# EAGLE design Controller_4TE_3.55 (EAGLE 6.2)
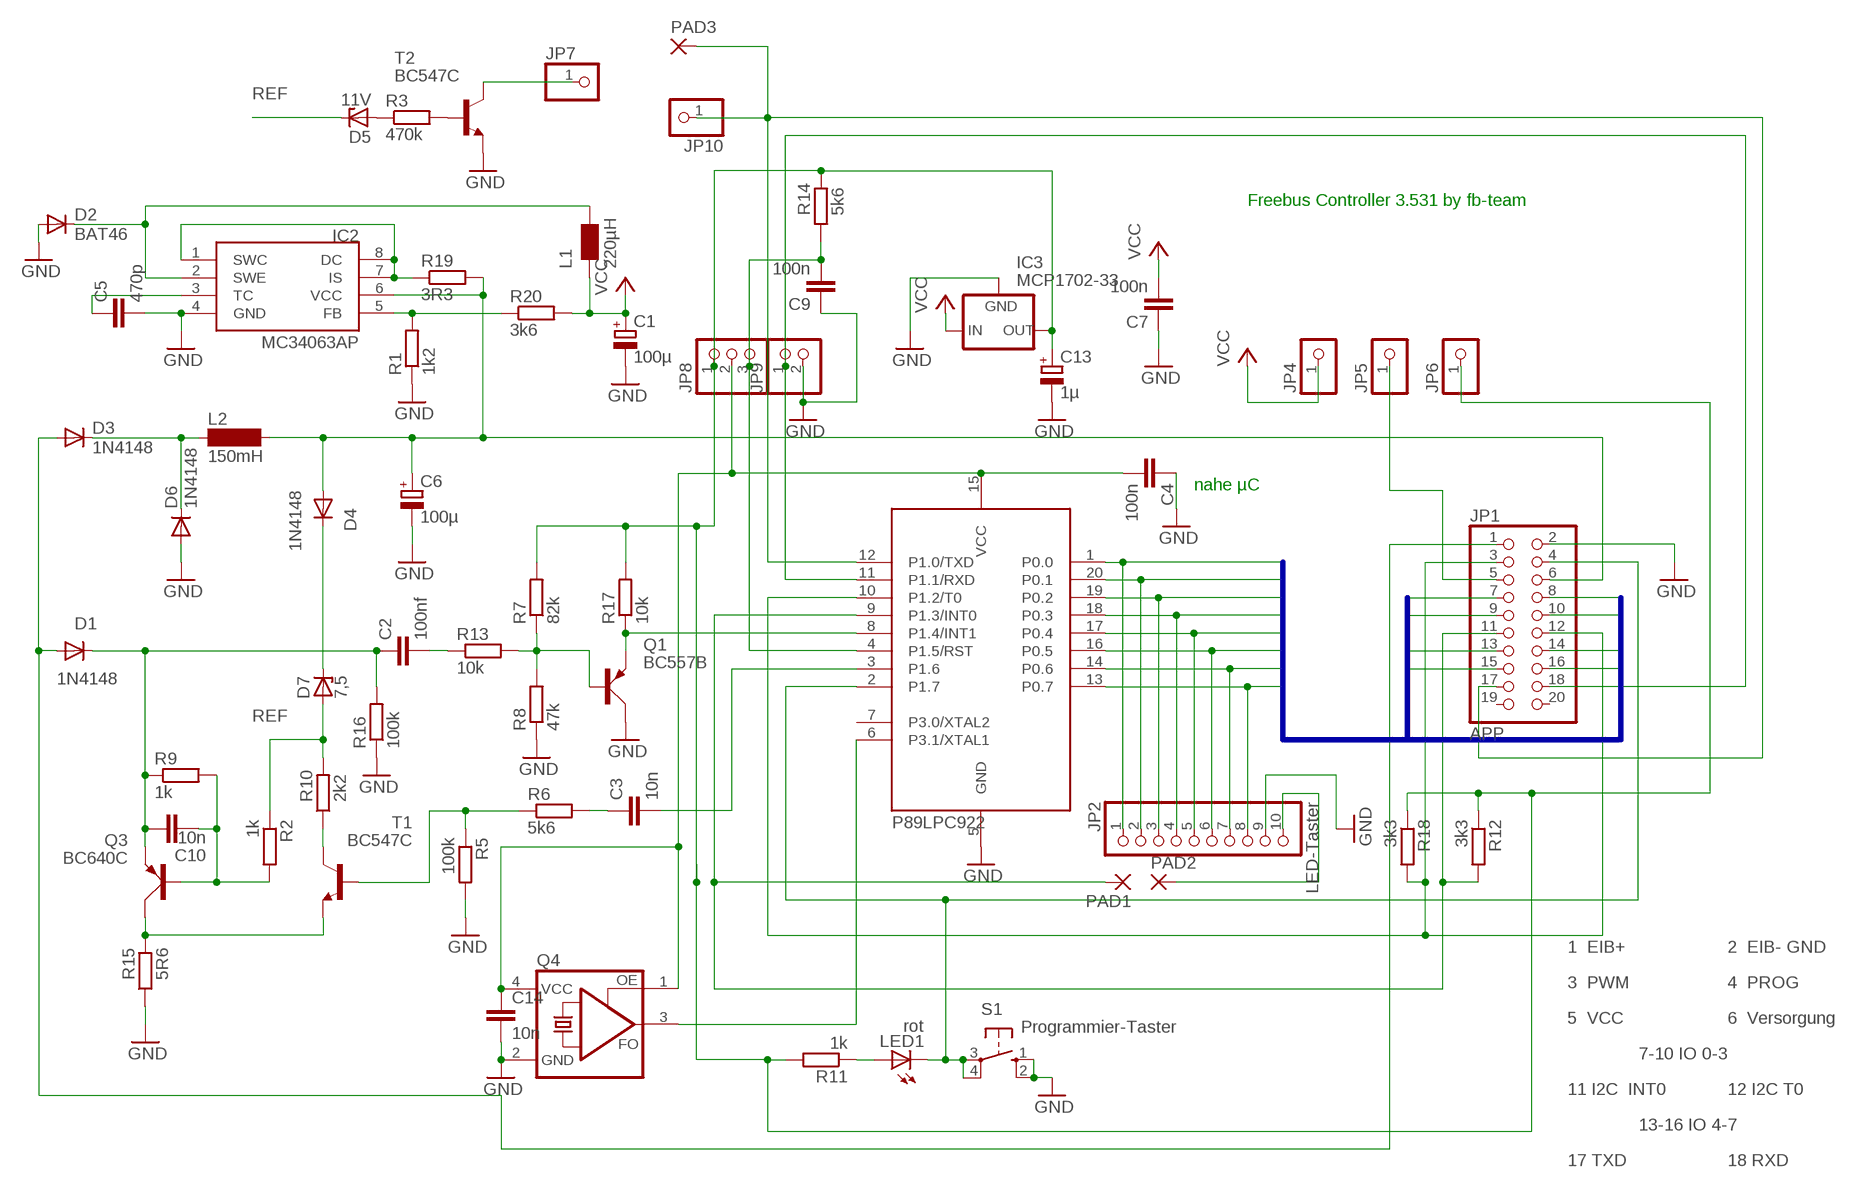
[diagram p0: schematic, sheet 1]

## Parts
C1  100µ  CPOL-EUE5-8.5  [E5-8,5]
C2  100nf  C-EU050-024X044  [C050-024X044]
C3  10n  C-EU050-024X044  [C050-024X044]
C4  100n  C-EU050-024X044  [C050-024X044]
C5  470p  C-EU025-024X044  [C025-024X044]
C6  100µ  CPOL-EUE5-8.5  [E5-8,5]
C7  100n  C-EU050-024X044  [C050-024X044]
C9  100n  C-EU050-024X044  [C050-024X044]
C10  10n  C-EU050-024X044  [C050-024X044]
C13  1µ  CPOL-EUE2-4  [E2-4]
C14  10n  C-EUC1206  [C1206]
D1  1N4148  1N4148DO35-7  [DO35-7]
D2  BAT46  DIODE-C1702-05  [C1702-05]
D3  1N4148  DIODE-D-2.5  [D-2.5]
D4  1N4148  1N4148DO35-10  [DO35-10]
D5  11V  ZENER-DIODEZD-10  [ZDIO-10]
D6  1N4148  DIODE-D-2.5  [D-2.5]
D7  7,5  ZENER-DIODEZD-7.5  [ZDIO-7.5]
IC1  89LPC922FN  89LPC922  [DIL20]
IC2  MC34063AP  [DIL08]
IC3  MCP1702-33  79LXX  [79LXX]
JP1  APP  PINHD-2X10  [2X10]
JP2  LED-Taster  PINHD-1X10  [1X10]
JP4  PINHD-1X1  [1X01]
JP5  PINHD-1X1  [1X01]
JP6  PINHD-1X1  [1X01]
JP7  PINHD-1X1  [1X01]
JP8  PINHD-1X3  [1X03]
JP9  PINHD-1X2  [1X02]
JP10  PINHD-1X1  [1X01]
L1  220µH  L_R85  [L_RAD_D8RM5]
L2  150mH  SD12-1000  [SD12_1000]
LED1  rot  LED3MM  [LED3MM]
PAD1  SMD2  [SMD1,27-2,54]
PAD2  SMD2  [SMD1,27-2,54]
PAD3  SMD2  [SMD1,27-2,54]
Q1  BC557B  BC557  [SOT54A]
Q3  BC640C  BC640  [SOT54D]
Q4  ASFL  [ASF]
R1  1k2  R-EU_0207/10  [0207/10]
R2  1k  R-EU_0207/7  [0207/7]
R3  470k  R-EU_0207/7  [0207/7]
R5  100k  R-EU_0207/10  [0207/10]
R6  5k6  R-EU_0207/7  [0207/7]
R7  82k  R-EU_0207/7  [0207/7]
R8  47k  R-EU_0207/7  [0207/7]
R9  1k  R-EU_0207/7  [0207/7]
R10  2k2  R-EU_0207/7  [0207/7]
R11  1k  R-EU_0207/7  [0207/7]
R12  3k3  R-EU_0207/10  [0207/10]
R13  10k  R-EU_0207/7  [0207/7]
R14  5k6  R-EU_0207/10  [0207/10]
R15  5R6  R-EU_0207/10  [0207/10]
R16  100k  R-EU_0207/7  [0207/7]
R17  10k  R-EU_0207/7  [0207/7]
R18  3k3  R-EU_0207/10  [0207/10]
R19  3R3  R-EU_0207/10  [0207/10]
R20  3k6  R-EU_0207/10  [0207/10]
S1  Programmier-Taster  10-XX  [B3F-10XX]
T1  BC547C  BC547  [TO92]
T2  BC547C  BC547  [TO92]

## Nets
/RESTET: C9.2 IC1.4(P1.5/RST) JP8.3 R14.1
DRAIN: C2.1 C10.1 D1.C Q3.E R9.1 R16.2
EIB_DC: C6.+ D4.A IC2.6(VCC) JP1.6 L2.2 R19.2
EIBIN: IC1.8(P1.4/INT1) Q1.E R17.1
GND: C1.- C4.1 C5.2 C6.- C7.1 C9.1 C13.- C14.2 D2.A D6.A IC1.5(GND) IC2.4(GND) IC3.GND JP1.2 JP2.9 JP9.2 Q1.C Q4.2(GND) R1.1 R5.2 R8.1 R15.1 R16.1 S1.1(S) S1.2(S1) T2.1(E)
INT0_TASTER: IC1.9(P1.3/INT0) JP1.11 PAD1.1(P) R12.2
N$1: C3.1 R6.2
N$2: C2.2 R13.1
N$3: IC2.5(FB) R1.2 R20.1
N$4: IC2.1(SWC) IC2.7(IS) IC2.8(DC) R19.1
N$5: C3.2 IC1.3(P1.6)
N$6: R10.1 T1.3(C)
N$7: Q3.C R15.2 T1.1(E)
N$8: D3.C D6.C L2.1
N$9: D4.C D7.C
N$10: D2.C IC2.2(SWE) L1.1
N$11: JP7.1 T2.3(C)
N$12: R5.1 R6.1 T1.2(B)
N$13: C5.1 IC2.3(TC)
N$14: Q1.B R7.1 R8.2 R13.2
N$15: C10.2 Q3.B R2.2 R9.2
N$16: D1.A D3.A JP1.1
N$17: IC1.6(P3.1/XTAL1) Q4.3(FO)
N$20: JP1.5 JP5.1
N$28: R3.2 T2.2(B)
N$29: JP2.10 PAD2.1(P)
N$30: IC1.11(P1.1/RXD) JP1.18 JP9.1
N$31: D5.A R3.1
N$41: LED1.A R11.1
P0.0: IC1.1(P0.0) JP1.7 JP2.1
P0.1: IC1.20(P0.1) JP1.8 JP2.2
P0.2: IC1.19(P0.2) JP1.9 JP2.3
P0.3: IC1.18(P0.3) JP1.10 JP2.4
P0.4: IC1.17(P0.4) JP1.13 JP2.5
P0.5: IC1.16(P0.5) JP1.14 JP2.6
P0.6: IC1.14(P0.6) JP1.15 JP2.7
P0.7: IC1.13(P0.7) JP1.16 JP2.8
PROG: IC1.2(P1.7) JP1.4 LED1.K(C) S1.3(P) S1.4(P1)
PWM: IC1.10(P1.2/T0) JP1.3 JP1.12 R18.2
REF: D5.C D7.A R2.1 R10.2
TXD: IC1.12(P1.0/TXD) JP1.17 JP10.1 PAD3.1(P)
VCC3V3: C1.+ C7.2 IC3.IN JP4.1 L1.2 R20.2 ; supply symbol labelled VCC
VCC_3V3: C13.+ IC3.OUT JP6.1 JP8.1 R7.2 R11.2 R12.1 R14.2 R17.2 R18.1
VCC_LPC: C4.2 C14.1 IC1.15(VCC) JP8.2 Q4.1(OE) Q4.4(VCC)
Unconnected: IC1.7(P3.0/XTAL2) JP1.19 JP1.20

## Buses
P0.[0..7]

## Notes on the sheet
- Freebus Controller 3.531 by fb-team
- nahe µC
- P89LPC922
- 1  EIB+ | 2  EIB- GND
- 3  PWM | 4  PROG
- 5  VCC | 6  Versorgung
- 7-10 IO 0-3
- 11 I2C  INT0 | 12 I2C T0
- 13-16 IO 4-7
- 17 TXD | 18 RXD

## Library data of the parts
C1 C6 C13 = rcl:CPOL-EU: POLARIZED CAPACITOR, European symbol
C2-C5 C7 C9 C10 C14 = rcl:C-EU: CAPACITOR, European symbol
D1 D4 = diode:1N4148: DIODE high speed (Philips)
D2 D3 D6 = diode:DIODE-: DIODE
D5 D7 = diode:ZENER-DIODE: Z-Diode
IC1 = micro-philips:89LPC922
IC2 = mc34063:MC34063
IC3 = v-reg:79LXX: VOLTAGE REGULATOR
JP1 = pinhead:PINHD-2X10: PIN HEADER
JP2 = pinhead:PINHD-1X10: PIN HEADER
JP4-JP7 JP10 = pinhead:PINHD-1X1: PIN HEADER
JP8 = pinhead:PINHD-1X3: PIN HEADER
JP9 = pinhead:PINHD-1X2: PIN HEADER
L1 = fbctrls1:L
L2 = inductor-neosid:SD12: INDUCTOR nominal inductance
LED1 = led:LED: LED OSRAM: - CHIPLED LG R971, LG N971, LY N971, LG Q971, LY Q971, LO R971, LY R971 LH N974, LH R974 LS Q976, LO Q976, LY Q976 LO Q996 - Hyper CHIPLED LW Q18S LB Q993, LB Q99A, LB R99A - SideLED LS A670, LO A670, LY A670, LG A670, LP A670 LB A673, LV A673, LT A673, LW A673 LH A674 LY A675 LS A676, LA A676, LO A676, LY A676, LW A676 LS A679, LY A679, LG A679 - Hyper Micro SIDELED® LS Y876, LA Y876, LO Y876, LY Y876 LT Y87S - SmartLED LW L88C, LW L88S LB L89C, LB L89S, LG L890 LS L89K, LO L89K, LY L89K LS L896, LA L896, LO L896, LY L896 - TOPLED LS T670, LO T670, LY T670, LG T670, LP T670 LSG T670, LSP T670, LSY T670, LOP T670, LYG T670 LG T671, LOG T671, LSG T671 LB T673, LV T673, LT T673, LW T673 LH T674 LS T676, LA T676, LO T676, LY T676, LB T676, LH T676, LSB T676, LW T676 LB T67C, LV T67C, LT T67C, LS T67K, LO T67K, LY T67K, LW E67C LS E67B, LA E67B, LO E67B, LY E67B, LB E67C, LV E67C, LT E67C LW T67C LS T679, LY T679, LG T679 LS T770, LO T770, LY T770, LG T770, LP T770 LB T773, LV T773, LT T773, LW T773 LH T774 LS E675, LA E675, LY E675, LS T675 LS T776, LA T776, LO T776, LY T776, LB T776 LHGB T686 LT T68C, LB T68C - Hyper Mini TOPLED® LB M676 - Mini TOPLED Santana® LG M470 LS M47K, LO M47K, LY M47K Source: http://www.osram.convergy.de - LUMILED® LXK2-PW12-R00, LXK2-PW12-S00, LXK2-PW14-U00, LXK2-PW14-V00 LXK2-PM12-R00, LXK2-PM12-S00, LXK2-PM14-U00 LXK2-PE12-Q00, LXK2-PE12-R00, LXK2-PE12-S00, LXK2-PE14-T00, LXK2-PE14-U00 LXK2-PB12-K00, LXK2-PB12-L00, LXK2-PB12-M00, LXK2-PB14-N00, LXK2-PB14-P00, LXK2-PB14-Q00 LXK2-PR12-L00, LXK2-PR12-M00, LXK2-PR14-Q00, LXK2-PR14-R00 LXK2-PD12-Q00, LXK2-PD12-R00, LXK2-PD12-S00 LXK2-PH12-R00, LXK2-PH12-S00 LXK2-PL12-P00, LXK2-PL12-Q00, LXK2-PL12-R00 Source: www.luxeon.com
PAD1-PAD3 = wirepad:SMD2: SMD PAD
Q1 = transistor-small-signal:BC557: PNP TRANSISTOR
Q3 = transistor-small-signal:BC640: PNP TRANSISTOR
Q4 = crystal:ASF*: CRYSTAL CLOCK OSCILLATORS 5.0 Vdc or 3.3 Vdc - LOW PROFILE ULTRA MINIATURE CERAMIC SURFACE MOUNT Source: http://www.abracon.com/Oscillators/asf1-L-L1.pdf
R1-R3 R5-R20 = rcl:R-EU_: RESISTOR, European symbol
S1 = switch-omron:10-XX: OMRON SWITCH
T1 T2 = transistor:BC547: NPN TRANSISTOR

## Board
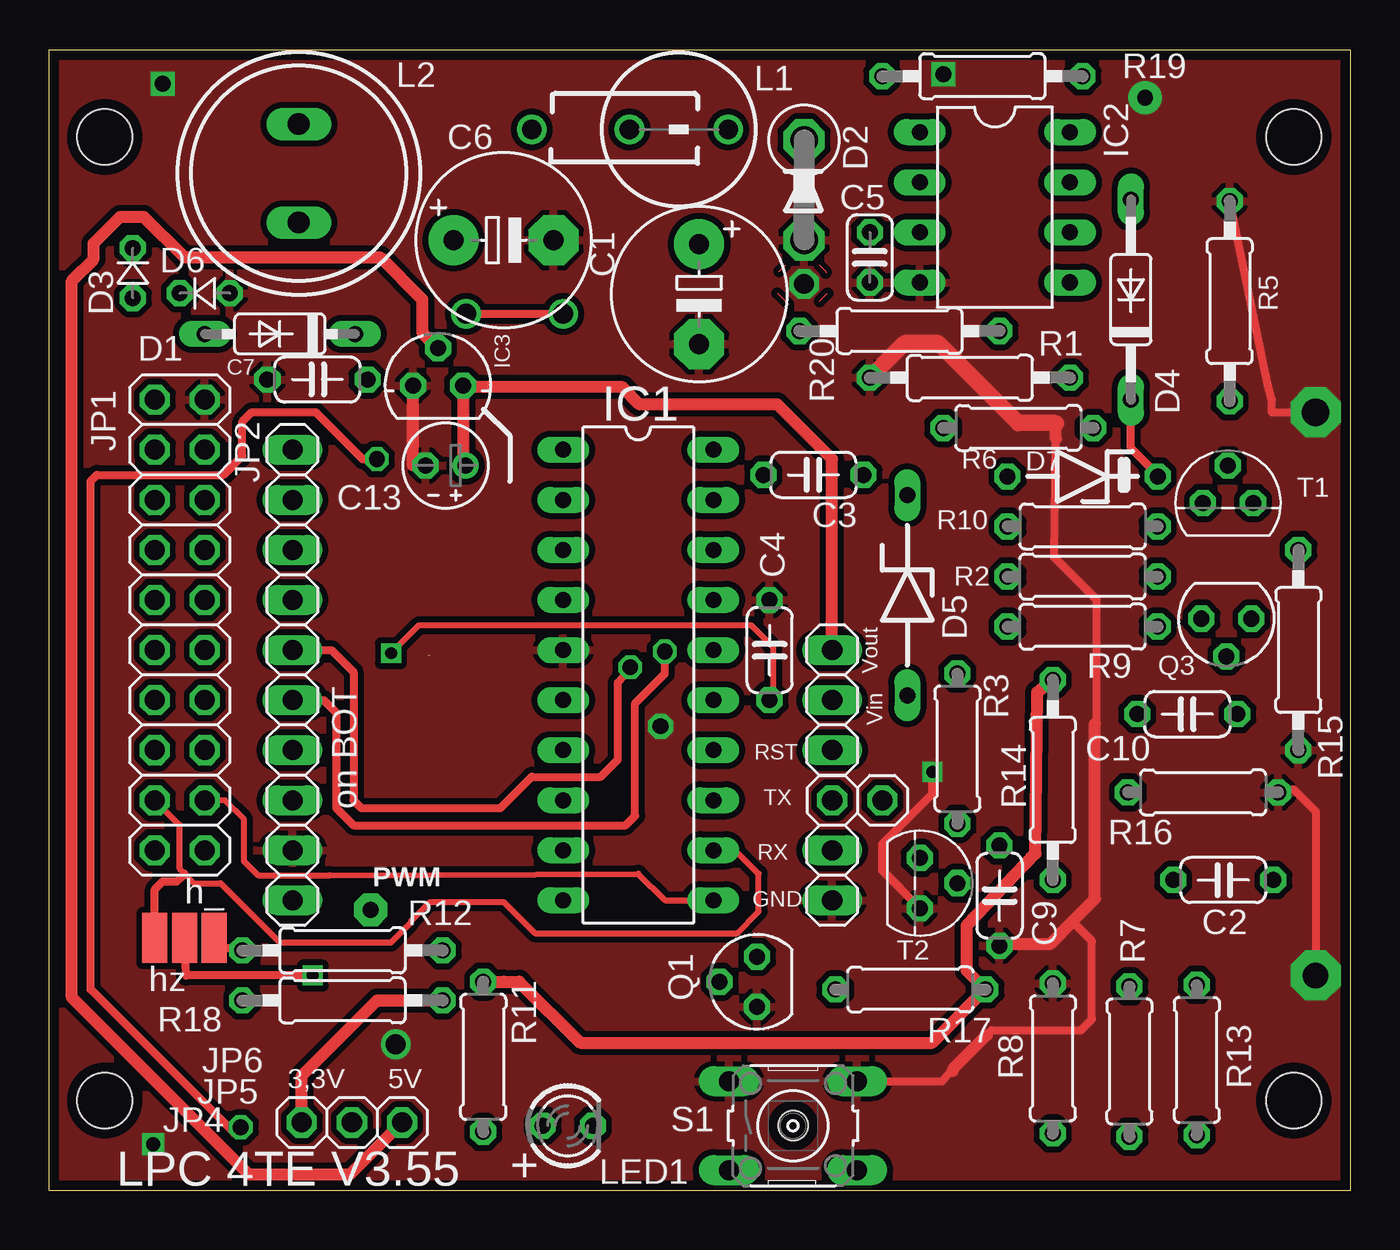
[diagram p1: board, top side]
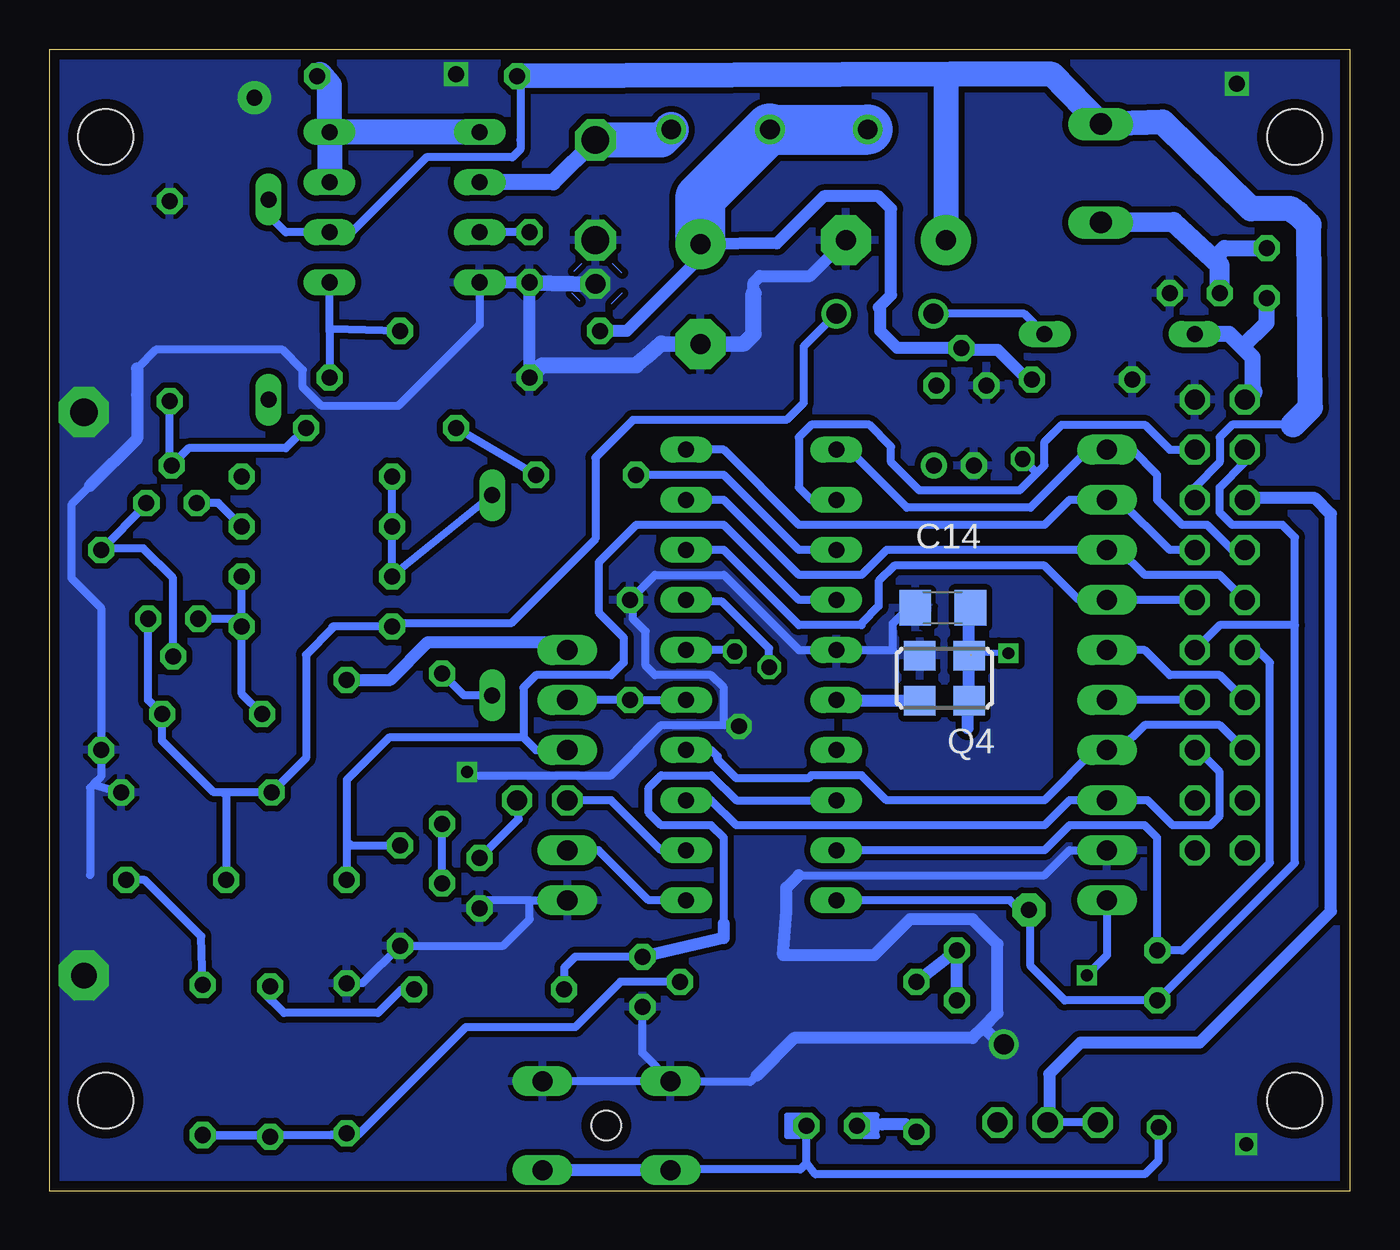
[diagram p2: board, bottom side, seen from below]

Size 66 x 57.9 mm. Coordinates in mm from the lower left corner, seen from the top.
Outline: 0,57.9 66,57.9 66,0 0,0 0,57.9
Copper layers (1*16): Top 0.035mm / dielectric 1.5mm / Bottom 0.035mm
Design rules: minimum track width 10mil, minimum drill 24mil, track to track 12mil, track to pad 12mil, pad to pad 12mil, via to via 12mil, smd to smd 8mil, copper to edge 20mil, drill to drill 8mil, minimum pad ring 10mil, minimum via ring 8mil, stop-mask expansion 4mil, vias tented up to drill 0mil, thermal gap 10mil
Holes 2.8 mm at 2.81,53.48 63.14,53.48 63.14,4.58 2.81,4.58
Holes 1.5 mm at 37.73,3.31
bRestrict: 5 lines

### Footprints (pad centres in the part's own frame; a part is rotated, then mirrored left to right if it is on the bottom)
E5-8,5 = drill 1.016 pad 2.54: + -2.54,0 | drill 1.016 pad 2.54 octagon: - 2.54,0
C050-024X044 = drill 0.813 octagon: 1 -2.54,0; 2 2.54,0
C025-024X044 = drill 0.813 octagon: 1 -1.27,0; 2 1.27,0
E2-4 = drill 0.813 pad 1.27: + -1.016,0 | drill 0.813 pad 1.27 octagon: - 1.016,0
C1206 = smd 1.6 x 1.8: 1 -1.4,0; 2 1.4,0
DO35-7 = drill 0.813 long: A 3.81,0; C -3.81,0
C1702-05 = drill 1.397 octagon: A 2.54,0; C -2.54,0
D-2.5 = drill 0.813 octagon: A 1.27,0; C -1.27,0
DO35-10 = drill 0.813 long: A 5.08,0; C -5.08,0
ZDIO-10 = drill 0.813 long: A 5.08,0; C -5.08,0
ZDIO-7.5 = drill 0.813 octagon: A 3.81,0; C -3.81,0
DIL20 = drill 0.813 long: 1 -11.43,-3.81; 2 -8.89,-3.81; 3 -6.35,-3.81; 4 -3.81,-3.81; 5 -1.27,-3.81; 6 1.27,-3.81; 7 3.81,-3.81; 8 6.35,-3.81; 9 8.89,-3.81; 10 11.43,-3.81; 11 11.43,3.81; 12 8.89,3.81; 13 6.35,3.81; 14 3.81,3.81; 15 1.27,3.81; 16 -1.27,3.81; 17 -3.81,3.81; 18 -6.35,3.81; 19 -8.89,3.81; 20 -11.43,3.81
DIL08 = drill 0.813 long: 1 -3.81,-3.81; 2 -1.27,-3.81; 3 1.27,-3.81; 4 3.81,-3.81; 5 3.81,3.81; 6 1.27,3.81; 7 -1.27,3.81; 8 -3.81,3.81
79LXX = drill 0.813 octagon: GND -1.27,0; IN 0,1.905; OUT 1.27,0
2X10 = drill 1.016 octagon: 1 -11.43,-1.27; 2 -11.43,1.27; 3 -8.89,-1.27; 4 -8.89,1.27; 5 -6.35,-1.27; 6 -6.35,1.27; 7 -3.81,-1.27; 8 -3.81,1.27; 9 -1.27,-1.27; 10 -1.27,1.27; 11 1.27,-1.27; 12 1.27,1.27; 13 3.81,-1.27; 14 3.81,1.27; 15 6.35,-1.27; 16 6.35,1.27; 17 8.89,-1.27; 18 8.89,1.27; 19 11.43,-1.27; 20 11.43,1.27
1X10 = drill 1.016 long: 1 -11.43,0; 2 -8.89,0; 3 -6.35,0; 4 -3.81,0; 5 -1.27,0; 6 1.27,0; 7 3.81,0; 8 6.35,0; 9 8.89,0; 10 11.43,0
1X01 = drill 1.016 octagon: 1 0,0
1X03 = drill 1.016 long: 1 -2.54,0; 2 0,0; 3 2.54,0
1X02 = drill 1.016 long: 1 -1.27,0; 2 1.27,0
L_RAD_D8RM5 = drill 1: 1 -2.5,0; 2 2.5,0
SD12_1000 = drill 1.1 long: 1 -2.5,0; 2 2.5,0
LED3MM = drill 0.813 octagon: A -1.27,0; K 1.27,0
SMD1,27-2,54 = smd 1.27 x 2.54: 1 0,0
SOT54A = drill 0.813 octagon: B 0,1.905; C -1.27,0; E 1.27,0
SOT54D = drill 0.813 octagon: B 1.27,0; C 0,1.905; E -1.27,0
ASF = smd 1.6 x 1.5: 1 -1.25,-1.15; 2 1.25,-1.15; 3 1.25,1.15; 4 -1.25,1.15
0207/10 = drill 0.813 octagon: 1 -5.08,0; 2 5.08,0
0207/7 = drill 0.813 octagon: 1 -3.81,0; 2 3.81,0
B3F-10XX = drill 1.016 long: 1 -3.251,2.261; 2 3.251,2.261; 3 -3.251,-2.261; 4 3.251,-2.261
TO92 = drill 0.813 octagon: 1 1.27,0; 2 0,1.905; 3 -1.27,0

### Placement (x,y rotation side)
C1  32.97,45.5 270 top
C2  59.56,15.77 0 top
C3  38.77,36.33 180 top
C4  36.54,27.44 270 top
C5  41.62,47.36 270 top
C6  23.05,48.24 0 top
C7  13.61,41.17 0 top
C9  48.21,14.98 90 top
C10  57.74,24.19 180 top
C13  20.11,36.81 180 top
C14  20.67,29.58 180 bottom
D1  11.7,43.47 180 top
D2  38.29,50.78 270 top
D3  4.24,46.57 270 top
D4  54.88,45.22 90 top
D5  43.53,30.22 270 top
D6  7.89,45.54 0 top
D7  52.42,36.25 180 top
IC1  29.88,26.17 270 top
IC2  47.97,49.9 270 top
IC3  19.72,40.85 0 top
JP1  6.62,28.71 270 top
JP2  12.34,26.17 270 top
JP4  17.89,3.47 0 top
JP5  15.35,3.47 0 top
JP6  12.81,3.47 0 top
JP7  42.26,19.82 0 top
JP8  39.72,24.9 270 top
JP9  39.72,16.01 270 top
JP10  39.72,19.82 0 top
L1  31.94,53.85 180 top
L2  12.65,51.63 90 top
LED1  26.3,3.31 0 top
PAD1  8.37,12.84 0 top
PAD2  6.86,12.84 0 top
PAD3  5.35,12.84 0 top
Q1  35.91,10.61 90 top
Q3  59.72,29.03 180 top
Q4  20.59,26.01 180 bottom
R1  46.7,41.25 0 top
R2  52.42,31.17 0 top
R3  46.07,22.44 270 top
R5  59.88,45.14 90 top
R6  49.16,38.71 180 top
R7  54.8,6.56 90 top
R8  50.91,6.72 270 top
R9  52.42,28.63 0 top
R10  52.42,33.71 180 top
R11  22.02,6.8 90 top
R12  14.88,12.2 180 top
R13  58.21,6.64 270 top
R14  50.91,20.85 90 top
R15  63.37,27.44 90 top
R16  58.53,20.22 180 top
R17  43.69,10.22 0 top
R18  14.88,9.66 180 top
R19  47.34,56.55 180 top
R20  43.13,43.63 180 top
S1  37.73,3.31 0 top
T1  59.8,34.9 0 top
T2  44.16,15.61 270 top

### Tracks (layer width: path | path; a pad name or v marks a point on that pad's centre or on a via)
/RESTET
  Bottom 0.406: IC1.4 27.97,29.98 31.78,33.79 36.23,33.79 38.13,31.88 38.13,29.34 36.86,28.07 36.86,26.8 37.5,26.17 41.31,26.17 41.94,25.54 41.94,23 | 41.94,23 41.31,22.36 JP8.3 | 50.91,17.76 50.91,20.85 48.77,23 41.94,23 | 50.91,17.76 R14.1 | C9.2 50.67,17.52 50.91,17.76
DRAIN  (via drill 1)
  Top 0.406: v21.15,44.51 v26.07,44.51
  Bottom 0.406: R16.2 57.18,20.22 | 57.18,20.22 57.66,20.22 60.28,22.84 C10.1 60.99,24.9 Q3.E | C2.1 57.02,20.06 57.18,20.22 | R16.2 | D1.C 16.54,44.51 v21.15,44.51 | R16.2 52.98,21.96 52.98,27.2 51.63,28.55 51.63,28.63 R9.1 48.45,28.79 42.58,28.79 38.29,33.08 38.29,37.2 36.39,39.11 28.61,39.11 27.73,39.98 27.73,42.84 v26.07,44.51
EIB_DC
  Bottom 0.406: JP1.6 7.89,35.7 6.62,36.97 6.62,38.23 5.99,38.87 2.89,38.87 | R19.2 42.1,56.17 42.1,53.32 42.1,52.84 42.5,52.44 46.86,52.44 50.67,48.63 IC2.6 54.01,48.63 54.88,49.51 D4.A | D4.A
  Bottom 1.27: 2.89,38.87 2.02,39.74 2.1,48.95 2.1,49.03 2.65,49.59 2.73,49.59 2.97,49.82 5.03,49.82 9.52,54.23 L2.2 15.11,56.65 20.35,56.65 | 20.35,56.65 R19.2 | C6.+ 20.51,56.49 20.35,56.65
EIBIN
  Bottom 0.406: IC1.8 31.15,19.82 32.42,21.09 34.96,21.09 35.59,20.45 35.59,19.18 34.96,18.55 32.42,18.55 31.78,17.91 31.78,12.84 | Q1.E 39.32,11.88 39.88,11.33 R17.1 | R17.1
  Bottom 0.61: 31.78,13.55 31.78,12.84 Q1.E
GND  (via drill 0.6, 0.7, 0.8, 0.8 pad 1.27, 0.8 pad 1.68, 1, 1.3 pad 2.54, 1.4 pad 2.54)
  Top 0.406: v64.25,39.51 62.02,39.51 62.02,40.14 61.79,41.01 R5.2 | 51.07,38.16 50.99,32.12 53.13,29.98 53.13,23.79 53.05,23.71 | v64.25,10.93 64.25,19.26 63.14,20.38 62.5,20.38 R16.1 | 47.58,7.91 47.82,8.15 52.34,8.15 52.9,8.71 52.9,12.68 51.9,13.67 | S1.2 45.31,5.57 45.87,6.21 | v44.8,21.25 44.8,20.14 42.26,17.6 42.26,16.25 T2.1
  Top 0.61: 53.05,23.71 53.05,14.82 51.9,13.67 50.75,12.52 48.29,12.52 C9.1 | 51.07,38.16 51.07,38.95 | 47.58,7.91 45.87,6.21 45.83,6.09 | C13.- 18.45,36.81 IC3.GND
  Top 0.813: 51.07,38.95 49.16,38.95 45.08,43.04 43.41,43.04 R1.1
  Bottom 0.406: 31.78,23.63 31.78,25.54 32.42,26.17 35.27,26.17 35.75,26.65 35.75,28.39 36.39,29.03 36.39,29.82 C4.1 | 31.78,23.63 34.96,23.63 37.5,21.09 44.64,21.09 v44.8,21.25 | JP2.9 14.24,17.28 15.51,16.01 27.97,16.01 | C4.1 35.27,31.25 31.78,31.25 27.97,27.44 IC1.5 23.18,27.44 23.21,27.47 23.21,28.79 22.42,29.58 C14.2 | Q1.C 35.91,7 S1.1 | S1.1 S1.2 | 41.62,14.74 41.62,13.79 42.97,12.44 48.05,12.44 C9.1 50.12,10.53 R8.1 | 63.93,16.01 63.93,20.45 63.77,20.61 | 63.77,20.61 R16.1 | 34.32,5.61 34.24,5.53 30.43,5.53 30.11,5.85 | 34.32,5.61 34.24,5.69 | S1.1 34.36,5.57 34.32,5.61 | IC2.4 44.16,43.95 48.29,39.82 52.18,39.82 53.13,40.77 53.13,41.65 54.17,42.68 60.59,42.68 61.55,41.73 | C4.1 | v31.01,23.57 31.47,23.63 31.78,23.63 | 63.93,35.77 64.88,34.82 64.88,31.09 63.37,29.58 R15.1 63.37,21.01 63.77,20.61 | 41.62,14.74 JP9.2 | 41.62,14.74 43.77,14.74 T2.1 | 61.55,40.38
  Bottom 0.61: S1.1 34.48,5.77 34.56,5.85 | 27.97,16.01 28.61,15.38 28.61,14.18 28.77,11.96 24.16,11.96 22.34,13.79 19.16,13.79 17.89,12.52 17.89,9.03 18.61,8.31 | 30.11,5.85 28.21,7.76 19.16,7.76 18.61,8.31 | IC2.4 C5.2 R1.1 | 61.55,41.73 61.55,40.38 61.55,38.16 63.93,35.77 | v17.57,7.44 17.34,7.04 18.61,8.31 | 30.27,45.54 30.27,46.09 29.96,46.41 27.42,46.41 C6.-
  Bottom 0.813: 30.27,45.54 30.27,43.47 30.75,43 C1.- 34.96,43 35.67,42.36 36.23,41.89 40.99,41.89 R1.1 | C5.2 v38.29,46.01
  other vias: 55.59,55.46 5.27,2.36 5.75,56.17 45.35,56.65
  pour Bottom: -1.16,-0.5 -1,58.55 66.94,58.55 66.94,-0.5
  pour Top: -1.16,58.87 -1.16,-0.82 67.26,-0.82 67.26,58.71 -0.68,58.71
INT0_TASTER
  Top 0.406: PAD1.1 8.41,12.32 9.68,12.32 R12.2
  Bottom 0.406: IC1.9 15.51,17.28 14.24,18.55 10.43,18.55 9.79,17.91 R12.2 8.53,12.2 4.08,16.64 4.08,26.8 4.71,27.44 JP1.11
N$1
  Bottom 0.406: C3.1 R6.2
N$2
  Bottom 0.406: C2.2 61.15,15.77 58.29,12.91 R13.1 | C2.2
N$3
  Bottom 0.406: 51.78,43.63 R1.2 | 51.78,43.63 IC2.5 | R20.1 51.7,43.71 51.78,43.63
N$4
  Bottom 1.27: IC2.1 IC2.8 | IC2.8 IC2.7 | IC2.8 51.78,56.09 52.26,56.65 R19.1
N$5
  Bottom 0.406: IC1.3 27.97,32.52 31.78,36.33 C3.2
N$6
  Bottom 0.406: T1.3 57.42,34.9 R10.1
N$7
  Bottom 0.406: T1.1 61.07,34.82 R15.2 63.29,32.6 61.23,32.6 59.72,31.09 Q3.C
N$8
  Bottom 0.813: D3.C 6.38,47.84 6.94,47.28
  Bottom 1.016: D6.C 6.62,46.97 6.94,47.28 8.96,49.15 L2.1
N$9
  Top 0.406: D4.C 54.88,37.68 56.23,36.33 D7.C | D4.C
N$10
  Bottom 0.813: IC2.2 40.43,51.17 D2.C
  Bottom 1.778: L1.1 34.44,53.83 34.96,53.32 D2.C
N$11
  Bottom 0.406: JP7.1 42.18,18.87 T2.3
N$12
  Bottom 0.406: R6.1 54.01,37.68 58.93,37.68 T1.2 | T1.2 59.56,36.81 | R5.1 59.88,36.97 T1.2
N$13
  Bottom 0.406: C5.1 IC2.3
N$14
  Bottom 0.406: Q1.B 37.02,10.61 39.32,8.31 44.88,8.31 50.36,2.83 51.78,2.83 R8.2 51.94,2.83 R13.2 55.28,2.83 R7.1
N$15
  Bottom 0.406: R2.2 R9.2 | Q3.B 56.63,29.03 R9.2 | R9.2 56.23,25.22 C10.2
N$16
  Bottom 0.61: JP1.1 5.27,40.22
  Bottom 0.813: 4.95,40.54 4.95,42.28 5.47,42.8 | 5.47,42.8 6.14,43.47 D1.A | D3.A 4.24,44.03 5.47,42.8
  Bottom 1.016: 5.27,40.22 4.95,40.54
N$17
  Bottom 0.305: IC1.6 26.07,24.86
  Bottom 0.61: Q4.3 26.03,24.86 IC1.6
N$18
  Top 0: 39.08,46.97 | 39.08,46.97 39.4,46.65 39.4,46.57
N$19
  Bottom 0.61: 19.4,23.47 19.4,24.9
N$20
  Bottom 0.61: JP5.1 15.27,3.55 15.27,5.93 13.68,7.52 7.65,7.52 0.98,14.18 0.98,34.35 1.78,35.14 5.27,35.14 JP1.5
N$21
  Top 0: 39.08,45.14 39.48,45.54
N$22
  Top 0: 37.02,46.65 37.34,46.97 | 37.34,46.97
N$23
  Top 0: 36.94,45.54 37.5,44.98
N$24
  Bottom 0: 36.94,46.57 37.42,47.05
N$25
  Bottom 0: 36.94,45.54 37.5,44.98
N$26
  Bottom 0: 39.08,45.14 39.48,45.54
N$27
  Bottom 0: 39.01,47.05 | 39.01,47.05 39.4,46.65
N$28
  Bottom 0.406: T2.2 R3.2
N$29  (via drill 0.6)
  Top 0.406: v13.37,10.93 6.94,10.93 PAD2.1
  Bottom 0.406: JP2.10 12.34,11.96 v13.37,10.93
N$30
  Top 0.305: JP1.18 8.92,19.82 9.87,18.87 9.87,16.72 10.59,16.01 14.24,16.01 29.88,16.09 31.23,14.74 IC1.11
  Bottom 0.406: IC1.11 35.59,14.74 38.13,17.28 JP9.1
N$31
  Bottom 0.406: D5.A 44.96,25.14 45.04,25.22 R3.1
N$41
  Bottom 0.254: 24.66,3.82 24.68,3.82 24.72,3.86 24.02,3.86 24,3.84 24,3.06 23.98,2.77 24.63,2.77 24.72,2.78 24.72,2.8 | 24.72,2.8 24.48,3.04 24.48,3.63 24.45,3.66 24.23,3.66 24.22,3.67 24.22,2.97 24.34,2.97 24.04,3.38 24.36,3.56 24.36,3.57 | 24.72,2.8 24.72,2.81 23.75,3.38
  Bottom 0.61: R11.1 22.57,3.39 23.75,3.38 LED1.A
P0.0
  Bottom 0.406: JP1.7 5.99,32.52 7.26,33.79 8.53,33.79 9.79,35.06 9.79,36.33 11.06,37.6 JP2.1 13.29,37.6 16.22,34.66 22.5,34.66 25.43,37.6 IC1.1
P0.1
  Bottom 0.406: IC1.20 31.78,37.6 27.97,33.79 15.51,33.79 14.24,35.06 JP2.2 11.7,35.06 9.16,32.52 JP1.8
P0.2
  Bottom 0.406: JP1.9 6.62,31.25 10.43,31.25 11.7,32.52 JP2.3 23.53,32.52 24.8,31.25 27.97,31.25 31.78,35.06 IC1.19
P0.3
  Bottom 0.406: IC1.18 31.78,32.52 27.97,28.71 24.8,28.71 24.8,28.79 23.92,29.66 23.92,30.93 23.13,31.73 15.51,31.73 14.88,31.09 14.32,30.54 13.76,29.98 JP2.4 JP1.10
P0.4  (via drill 0.8)
  Top 0.406: JP2.5 14.32,27.44 15.43,26.33 15.43,19.82 15.83,19.42 22.89,19.42 24.48,21.01 27.97,21.01 28.84,21.88 28.84,25.77 v29.48,26.57
  Bottom 0.406: JP1.13 6.62,26.17 9.16,26.17 10.43,27.44 JP2.5 | v29.48,26.57 29.48,27.52 31.86,29.9 33.61,29.9 IC1.17
P0.5  (via drill 0.8)
  Top 0.406: JP2.6 13.92,24.9 14.56,24.27 14.56,19.42 15.43,18.55 29.24,18.55 29.72,19.03 29.72,24.74 31.23,26.25 v31.23,27.36
  Bottom 0.406: JP1.14 JP2.6 | v31.23,27.36 31.15,27.28 31.31,27.44 IC1.16
P0.6
  Bottom 0.406: JP1.15 6.62,23.63 10.43,23.63 11.7,22.36 JP2.7 12.97,22.36 15.51,19.82 23.53,19.82 24.8,21.09 27.34,21.09 27.5,20.93 31.15,20.93 | IC1.14 32.42,22.36 32.1,22.04 32.1,21.88 31.15,20.93 | 31.15,20.93 | 31.15,20.93
P0.7
  Bottom 0.406: IC1.13 32.42,19.82 31.15,18.55 15.51,18.55 14.24,19.82 JP2.8 10.27,19.82 9,18.55 7.1,18.55 6.62,19.03 6.62,21.25 7.73,22.36 JP1.16
PROG  (via drill 0.8)
  Top 0.406: v16.62,37.12 15.91,37.12 13.53,39.51 10.27,39.51 9.79,39.03 9.79,37.28 8.84,36.33 2.41,36.33 2.1,36.01 2.1,10.22 9.4,2.91 v9.72,3.23
  Bottom 0.254: 28.21,3.74 28.37,3.74 28.37,2.94 28.02,2.75 27.96,2.75 27.96,2.76 28.44,2.76 28.59,2.77 28.59,3.84 27.94,3.84 27.94,3.67 LED1.K
  Bottom 0.406: JP1.4 9.16,37.6 10.43,38.87 14.64,38.87 15.51,38 15.51,36.81 15.91,36.41 | IC1.2 27.34,35.06 27.97,35.7 27.97,38.23 27.34,38.87 24.4,38.87 23.29,37.76 23.29,36.97 21.86,35.54 16.78,35.54 15.91,36.41 | 27.57,1.41 LED1.K | 27.57,1.41 27.89,1.09 34.45,1.09 S1.3 | v16.62,37.12 15.91,36.41 | v9.72,3.23 9.72,1.56 10.43,0.85 26.82,0.85 27.15,0.85 | 27.15,0.85 27.57,1.41 | 27.15,0.85 27.1,0.85
  Bottom 0.61: 34.56,1.05 S1.3 33.57,1.05 | 34.56,1.05 S1.4 | 34.56,1.05 34.56,1.25
PWM  (via drill 0.8 pad 1.68)
  Bottom 0.406: v16.3,14.26 16.78,14.74 | v16.3,14.26 16.78,14.26 17.26,14.74 IC1.10 | 2.81,28.71 2.81,16.64 R18.2 14.48,9.66 16.22,11.41 16.22,14.26 v16.3,14.26 | 2.81,28.71 6.62,28.71 JP1.12 | JP1.3 5.35,36.97 6.62,35.7 6.62,34.42 5.99,33.79 3.45,33.79 2.81,33.16 2.81,28.71
REF
  Bottom 0.406: R10.2 | R2.1 R10.2 | R2.1 | D7.A | R10.2 D7.A | D5.C 48.45,31.33 R2.1
TXD
  Top 0.305: IC1.12 34.8,17.28 35.99,16.09 35.99,14.18 34.88,13.07 24.64,13.07 23.05,14.66 19.32,14.66 18.37,13.71 18.29,13.55 17.34,12.6 11.7,12.6 8.68,15.61 7.33,15.61 6.86,16.09 6.62,16.33 6.62,18.55 JP1.17
  Top 0.406: PAD3.1 5.35,15.3 5.75,15.69 6.46,15.69 6.86,16.09
  Bottom 0.406: IC1.12 34.96,17.28 37.5,19.82 JP10.1
VCC3V3  (via drill 1)
  Top 0.61: JP4.1 15.27,0.85 10.11,0.85 1.14,9.82 1.14,46.17 2.25,47.28 2.25,48.08 3.6,49.43 4.79,49.43 6.86,47.36 16.78,47.36 18.92,45.22 18.92,43.55 IC3.IN
  Bottom 0.61: R20.2 36.7,43.63 32.97,47.36 C1.+ 29.08,48.08 26.7,50.46 23.92,50.46 23.29,49.82 23.29,45.46 23.92,44.82 23.84,44.74 23.84,43.63 22.97,42.76 IC3.IN 19.64,42.68 17.89,42.68 16.38,41.17 C7.2
  Bottom 2.54: v24.48,53.85 L1.2 29.44,53.91 32.97,50.38 32.97,48.08 C1.+
VCC_3V3
  Top 0.61: JP6.1 12.81,5.85 16.62,9.66 R18.1 | R11.2 23.05,10.61 23.84,10.61 26.94,7.52 44.8,7.52 R17.2 46.55,11.17 46.55,13.47 50.04,17.12 50.12,25.3 R14.2 | C13.+ 20.99,36.81 IC3.OUT 20.99,40.77 29.08,40.77 29.96,39.9 36.94,39.9 39.72,37.12 JP8.1
  Bottom 0.406: JP6.1 15.27,3.47 | R7.2 55.2,10.14 54.09,9.03 49.32,9.03 48.13,10.22 R17.2
  Bottom 0.61: R18.1 R12.1 R11.2 | R14.2 48.69,25.93 46.78,27.84 40.12,27.84 JP8.1
VCC_LPC  (via drill 0.6)  (1 unrouted)
  Top 0.305: C4.2 36.7,25.06 36.7,27.6 35.59,28.71 18.77,28.71 17.73,27.68 v17.34,27.28
  Bottom 0.305: Q4.1 19.27,27.16 | v17.34,27.28 19.16,27.28 19.24,27.2 | 19.34,29.12 C14.1
  Bottom 0.406: C4.2 IC1.15 | C4.2 | JP8.2 | C4.2 JP8.2 | C4.2
  Bottom 0.61: 19.34,29.12 Q4.1 Q4.4

### Text on the board
tPlace: Vout | on BOT | Vin | RST | TX | RX | PWM | h_ | GND | hz | 3,3V | 5V | +
tNames: LPC 4TE V3.55
tValues: auf Lötseite: